# Altium project FIT_TCM.PrjPcb (part 8 of 9)

## Sheet FIT_HDMI_X21-17.SchDoc: FIT_PM12 board
size 420 x 297 mm; CheckedBy: G.Kasprowicz; Author: INR Moscow; CompanyName: WUT ISE; DrawnBy: M.Podgórski; Organization: WUT ISE; Address1: PW ISE; Address2: Nowowiejska 15/19 00-665 Warsaw; Address3: gkasprow@gmail.com; Revision: 2; SheetNumber: -; SheetTotal: -; ModifiedBy: -; CheckedDate: -; Title2: Title 2; DivGrp: WUT ISE; Designer: INR RAS; ModifiedDate: -; ProjectName: Sensor Box
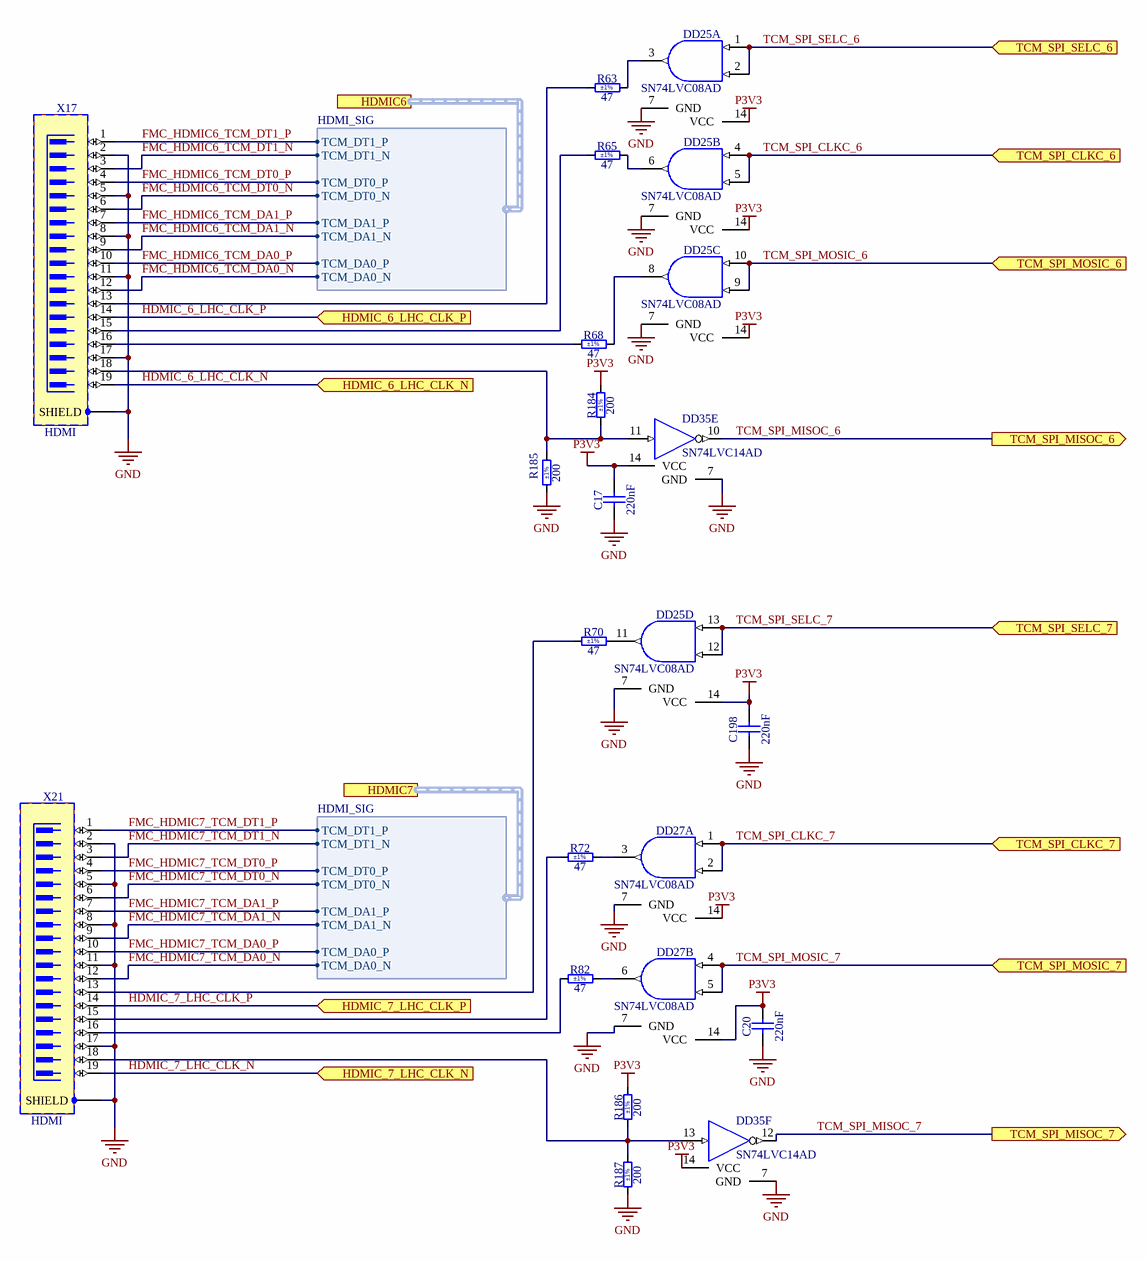
[diagram p27: FIT_HDMI_X21-17.SchDoc]

### Parts
C17  220nF  [CAPC2012X135N]
C20  220nF  [CAPC2012X135N]
C198  220nF  [CAPC2012X135N]
DD25  SN74LVC08AD  [SOIC127P600X175-14N]  (parts A,B,C,D of 4)
DD27  SN74LVC08AD  [SOIC127P600X175-14N]  (parts A,B of 4)
DD35  SN74LVC14AD  [SOIC127P600X175-14N]  (parts E,F of 6)
R63  47  Tolerance: ±1%  [RESC2012X60N]
R65  47  Tolerance: ±1%  [RESC2012X60N]
R68  47  Tolerance: ±1%  [RESC2012X60N]
R70  47  Tolerance: ±1%  [RESC2012X60N]
R72  47  Tolerance: ±1%  [RESC2012X60N]
R82  47  Tolerance: ±1%  [RESC2012X60N]
R184  200  Tolerance: ±1%  [RESC2012X60N]
R185  200  Tolerance: ±1%  [RESC2012X60N]
R186  200  Tolerance: ±1%  [RESC2012X60N]
R187  200  Tolerance: ±1%  [RESC2012X60N]
X17  HDMI  [TYCO_2007435-1]
X21  HDMI  [TYCO_2007435-1]

### Ports
HDMIC6 (harness HDMI_SIG), HDMIC7 (harness HDMI_SIG), HDMIC_6_LHC_CLK_N (in), HDMIC_6_LHC_CLK_P (in), HDMIC_7_LHC_CLK_N (in), HDMIC_7_LHC_CLK_P (in), TCM_SPI_CLKC_6 (in), TCM_SPI_CLKC_7 (in), TCM_SPI_MISOC_6 (out), TCM_SPI_MISOC_7 (out), TCM_SPI_MOSIC_6 (in), TCM_SPI_MOSIC_7 (in), TCM_SPI_SELC_6 (in), TCM_SPI_SELC_7 (in)

### Harnesses
HDMI_SIG: TCM_DT1_P, TCM_DT1_N, TCM_DT0_P, TCM_DT0_N, TCM_DA1_P, TCM_DA1_N, TCM_DA0_P, TCM_DA0_N

### Nets
GND: C17.1 C20.1 C198.1 DD25.7(GND) DD27.7(GND) DD35.7(GND) R185.1 R187.1 X17.2 X17.5 X17.8 X17.11 X17.17 X17.SHIELD X21.2 X21.5 X21.8 X21.11 X21.17 X21.SHIELD
P3V3: C17.2 C20.2 C198.2 DD25.14(VCC) DD27.14(VCC) DD35.14(VCC) R184.2 R186.2  [also labelled VCC]
FMC_HDMIC6_TCM_DA0_N: X17.12 ; port HDMIC6.TCM_DA0_N  [project net HDMIC6.TCM_DA0_N]
FMC_HDMIC6_TCM_DA0_P: X17.10 ; port HDMIC6.TCM_DA0_P  [project net HDMIC6.TCM_DA0_P]
FMC_HDMIC6_TCM_DA1_N: X17.9 ; port HDMIC6.TCM_DA1_N  [project net HDMIC6.TCM_DA1_N]
FMC_HDMIC6_TCM_DA1_P: X17.7 ; port HDMIC6.TCM_DA1_P  [project net HDMIC6.TCM_DA1_P]
FMC_HDMIC6_TCM_DT0_N: X17.6 ; port HDMIC6.TCM_DT0_N  [project net HDMIC6.TCM_DT0_N]
FMC_HDMIC6_TCM_DT0_P: X17.4 ; port HDMIC6.TCM_DT0_P  [project net HDMIC6.TCM_DT0_P]
FMC_HDMIC6_TCM_DT1_N: X17.3 ; port HDMIC6.TCM_DT1_N  [project net HDMIC6.TCM_DT1_N]
FMC_HDMIC6_TCM_DT1_P: X17.1 ; port HDMIC6.TCM_DT1_P  [project net HDMIC6.TCM_DT1_P]
FMC_HDMIC7_TCM_DA0_N: X21.12 ; port HDMIC7.TCM_DA0_N  [project net HDMIC7.TCM_DA0_N]
FMC_HDMIC7_TCM_DA0_P: X21.10 ; port HDMIC7.TCM_DA0_P  [project net HDMIC7.TCM_DA0_P]
FMC_HDMIC7_TCM_DA1_N: X21.9 ; port HDMIC7.TCM_DA1_N  [project net HDMIC7.TCM_DA1_N]
FMC_HDMIC7_TCM_DA1_P: X21.7 ; port HDMIC7.TCM_DA1_P  [project net HDMIC7.TCM_DA1_P]
FMC_HDMIC7_TCM_DT0_N: X21.6 ; port HDMIC7.TCM_DT0_N  [project net HDMIC7.TCM_DT0_N]
FMC_HDMIC7_TCM_DT0_P: X21.4 ; port HDMIC7.TCM_DT0_P  [project net HDMIC7.TCM_DT0_P]
FMC_HDMIC7_TCM_DT1_N: X21.3 ; port HDMIC7.TCM_DT1_N  [project net HDMIC7.TCM_DT1_N]
FMC_HDMIC7_TCM_DT1_P: X21.1 ; port HDMIC7.TCM_DT1_P  [project net HDMIC7.TCM_DT1_P]
HDMIC_6_LHC_CLK_N: X17.19 ; port HDMIC_6_LHC_CLK_N  [project net HDMIC_LHC.6_LHC_CLK_N]
HDMIC_6_LHC_CLK_P: X17.14 ; port HDMIC_6_LHC_CLK_P  [project net HDMIC_LHC.6_LHC_CLK_P]
HDMIC_7_LHC_CLK_N: X21.19 ; port HDMIC_7_LHC_CLK_N  [project net HDMIC_LHC.7_LHC_CLK_N]
HDMIC_7_LHC_CLK_P: X21.14 ; port HDMIC_7_LHC_CLK_P  [project net HDMIC_LHC.7_LHC_CLK_P]
TCM_SPI_CLKC_6: DD25.4(A) DD25.5(B) ; port TCM_SPI_CLKC_6
TCM_SPI_CLKC_7: DD27.1(A) DD27.2(B) ; port TCM_SPI_CLKC_7
TCM_SPI_MISOC_6: DD35.10(OUT) ; port TCM_SPI_MISOC_6
TCM_SPI_MISOC_7: DD35.12(OUT) ; port TCM_SPI_MISOC_7
TCM_SPI_MOSIC_6: DD25.9(B) DD25.10(A) ; port TCM_SPI_MOSIC_6
TCM_SPI_MOSIC_7: DD27.4(A) DD27.5(B) ; port TCM_SPI_MOSIC_7
TCM_SPI_SELC_6: DD25.1(A) DD25.2(B) ; port TCM_SPI_SELC_6
TCM_SPI_SELC_7: DD25.12(B) DD25.13(A) ; port TCM_SPI_SELC_7
NetDD25_3: DD25.3(Y) R63.2
NetDD25_6: DD25.6(Y) R65.2
NetDD25_8: DD25.8(Y) R68.2
NetDD25_11: DD25.11(Y) R70.2
NetDD27_3: DD27.3(Y) R72.2
NetDD27_6: DD27.6(Y) R82.2
NetDD35_11: DD35.11(IN) R184.1 R185.2 X17.18
NetDD35_13: DD35.13(IN) R186.1 R187.2 X21.18
NetR63_1: R63.1 X17.13
NetR65_1: R65.1 X17.15
NetR68_1: R68.1 X17.16
NetR70_1: R70.1 X21.13
NetR72_1: R72.1 X21.15
NetR82_1: R82.1 X21.16

### Notes on the sheet
- Project/Equipment
- Document
- Designer
- Drawn by
- Check.by
- Copyright WUT ISE 2024.
  This documentation describes Open Hardware and is licensed under the CERN OHL v.2. You may redistribute and modify this documentation under the terms of the CERN OHL v.2. (http://ohwr.org/CERNOHL). This documentation is distributed WITHOUT ANY EXPRESS OR IMPLIED WARRANTY, INCLUDING OF MERCHANTABILITY, SATISFACTORY QUALITY AND FITNESS FOR A PARTICULAR PURPOSE. Please see the CERN OHL v.2 for applicable conditions.
- Contact
- File
- Last Mod.
- Print Date
- Sheet
- Size
- A3
- of
- Rev

### Library data of the parts
C17 C20 C198 = CC0805_220NF_50V_10%_X7R: Non-polarised capacitor; Part Description: SMD Multilayer Chip Ceramic Capacitor; Manufacturer: GENERIC; Manufacturer1 Part Number: GRM21BR71H224KA01L; Voltage: 50V; TC: X7R; Tolerance: ±10%; Part Number: CC0805_220NF_50V_10%_X7R; Component Kind: Standard; Component Type: Standard; Pin Count: 2; Value: 220nF; Status: Preferred; Manufacturer Part Number: CC0805_220NF_50V_10%_X7R; Case: 0805; Mounted: Yes; Socket: No; SMD: Yes; Sense: No; Manufacturer1 Example: MURATA; Manufacturer1 ComponentHeight: 1.35mm; HelpURL: \\cern.ch\dfs\Applications\Altium\Datasheets\CC0805_X7R_MURATA.pdf; Author: CERN DEM JLC; CreateDate: 03.12.2007; LatestRevisionDate: 03.12.2007
DD25 DD27 = SN74LVC08AD: Quad 2-Input AND Gate; Part Description: Quadruple 2-Input Positive-AND Gate; Manufacturer: TEXAS INSTRUMENTS; PressFit: No; Bonding: No; Part Number: SN74LVC08AD; Component Kind: Standard; Component Type: Standard; Device: SN74LVC08AD; PackageDescription: SOIC 14, Pitch 1.27mm - Body 4x8.75mm, IPC Medium Density; Manufacturer Part Number: SN74LVC08AD; Pin Count: 14; Case: SOIC14; Mounted: Yes; Socket: No; SMD: Yes; Sense: No; ComponentHeight: 1.75mm; Author: CERN DEM JLC; HelpURL: \\cern.ch\dfs\Applications\Altium\Datasheets\SN74LVC08AD.pdf; CreateDate: 21.03.2012; LatestRevisionDate: 21.03.2012
DD35 = SN74LVC14AD: Hex Schmitt-Trigger Inverter; Manufacturer: TEXAS INSTRUMENTS; PressFit: No; Bonding: No; Part Number: SN74LVC14AD; Component Kind: Standard; Component Type: Standard; Device: SN74LVC14AD; PackageDescription: SOIC 14, Pitch 1.27mm - Body 4x8.75mm, IPC Medium Density; Part Description: Hex Schmitt-Trigger Inverter; Manufacturer Part Number: SN74LVC14AD; Pin Count: 14; Case: SOIC14; Mounted: Yes; Socket: No; SMD: Yes; Sense: No; ComponentHeight: 1.75mm; Author: CERN DEM JMW; HelpURL: \\cern.ch\dfs\Applications\Altium\Datasheets\SN74LVC14AD.pdf; CreateDate: 29.09.2008; LatestRevisionDate: 29.09.2008
R63 R65 R68 R70 R72 R82 = R0805_47R_1%_0.125W_100PPM: Resistor - 1%; Part Description: General Purpose Thick Film Chip Resistor; Manufacturer: GENERIC; Manufacturer1 Part Number: NRC10F47R0TRF; Power: 0.125W; TC: ±100ppm/°C; PressFit: No; Part Number: R0805_47R_1%_0.125W_100PPM; Component Kind: Standard; Component Type: Standard; Pin Count: 2; Value: 47; Status: Preferred; Manufacturer Part Number: R0805_47R_1%_0.125W_100PPM; Case: 0805; Mounted: Yes; Sense: No; Socket: No; SMD: Yes; Manufacturer1 Example: NIC COMPONENT; Manufacturer1 ComponentHeight: 0.6mm; HelpURL: \\cern.ch\dfs\Applications\Altium\Datasheets\R0805_NIC_NRC.pdf; Author: CERN DEM JLC; CreateDate: 03.12.2007; LatestRevisionDate: 13.03.2008
R184-R187 = R0805_200R_1%_0.125W_100PPM: Resistor - 1%; Part Description: General Purpose Thick Film Chip Resistor; Manufacturer: GENERIC; Manufacturer1 Part Number: NRC10F2000TRF; Power: 0.125W; TC: ±100ppm/°C; PressFit: No; Part Number: R0805_200R_1%_0.125W_100PPM; Component Kind: Standard; Component Type: Standard; Pin Count: 2; Value: 200; Status: Preferred; Manufacturer Part Number: R0805_200R_1%_0.125W_100PPM; Case: 0805; Mounted: Yes; Sense: No; Socket: No; SMD: Yes; Manufacturer1 Example: NIC COMPONENT; Manufacturer1 ComponentHeight: 0.6mm; HelpURL: \\cern.ch\dfs\Applications\Altium\Datasheets\R0805_NIC_NRC.pdf; Author: CERN DEM JLC; CreateDate: 03.12.2007; LatestRevisionDate: 13.03.2008
X17 X21 = TYCO_2007435-1: Connector HDMI 19 Male + 1 Shield; Part Description: 0.578mm Pitch, Through-Hole Right Angle 19 Contacts Flag-HDMI Type-A Receptacle Thru Hole Mounting Pads; Manufacturer: TYCO ELECTRONICS; PressFit: No; Part Number: TYCO_2007435-1; Component Kind: Standard; Component Type: Standard; Pin Count: 23; Family: HDMI; Mounted: Yes; Socket: No; SMD: No; Sense: No; Status: None; Manufacturer Part Number: 2007435-1; ComponentHeight: 16.4mm; HelpURL: \\cern.ch\dfs\Applications\Altium\Datasheets\TYCO_2007435-1.pdf; Author: CERN DEM MR; CreateDate: 05.07.2016; LatestRevisionDate: 05.07.2016

## Sheet FIT_HDMI_X34-28.SchDoc: FIT_PM12 board
size 420 x 297 mm; CheckedBy: G.Kasprowicz; Author: INR Moscow; CompanyName: WUT ISE; DrawnBy: M.Podgórski; Organization: WUT ISE; Address1: PW ISE; Address2: Nowowiejska 15/19 00-665 Warsaw; Address3: gkasprow@gmail.com; Revision: 2; SheetNumber: -; SheetTotal: -; ModifiedBy: -; CheckedDate: -; Title2: Title 2; DivGrp: WUT ISE; Designer: INR RAS; ModifiedDate: -; ProjectName: Sensor Box
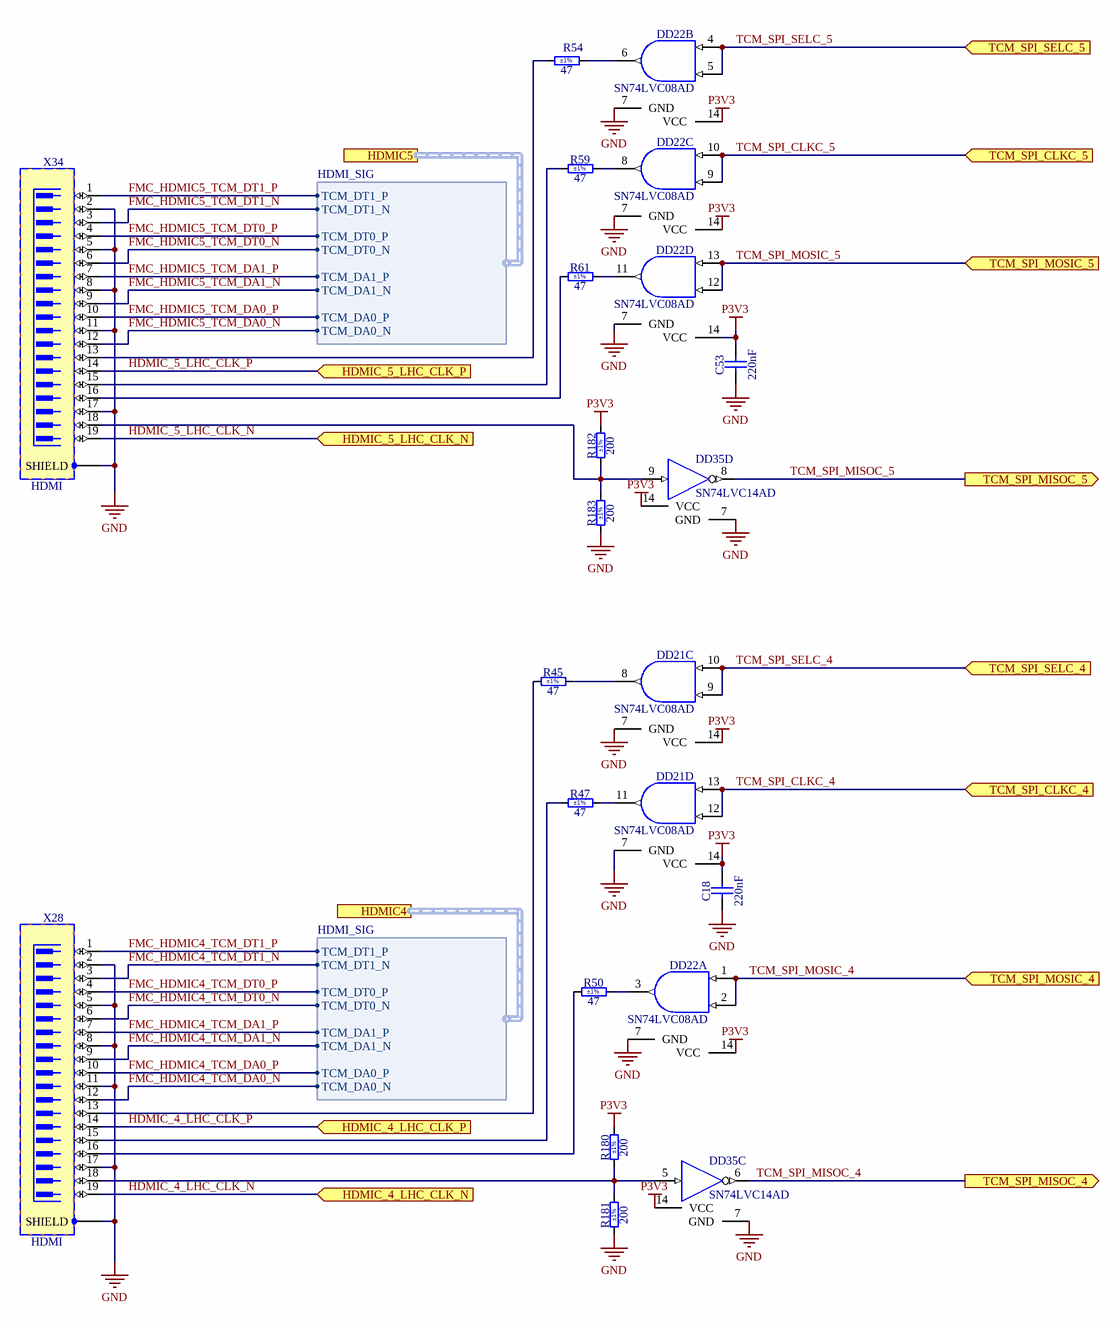
[diagram p28: FIT_HDMI_X34-28.SchDoc]

### Parts
C18  220nF  [CAPC2012X135N]
C53  220nF  [CAPC2012X135N]
DD21  SN74LVC08AD  [SOIC127P600X175-14N]  (parts C,D of 4)
DD22  SN74LVC08AD  [SOIC127P600X175-14N]  (parts A,B,C,D of 4)
DD35  SN74LVC14AD  [SOIC127P600X175-14N]  (parts C,D of 6)
R45  47  Tolerance: ±1%  [RESC2012X60N]
R47  47  Tolerance: ±1%  [RESC2012X60N]
R50  47  Tolerance: ±1%  [RESC2012X60N]
R54  47  Tolerance: ±1%  [RESC2012X60N]
R59  47  Tolerance: ±1%  [RESC2012X60N]
R61  47  Tolerance: ±1%  [RESC2012X60N]
R180  200  Tolerance: ±1%  [RESC2012X60N]
R181  200  Tolerance: ±1%  [RESC2012X60N]
R182  200  Tolerance: ±1%  [RESC2012X60N]
R183  200  Tolerance: ±1%  [RESC2012X60N]
X28  HDMI  [TYCO_2007435-1]
X34  HDMI  [TYCO_2007435-1]

### Ports
HDMIC4 (harness HDMI_SIG), HDMIC5 (harness HDMI_SIG), HDMIC_4_LHC_CLK_N (in), HDMIC_4_LHC_CLK_P (in), HDMIC_5_LHC_CLK_N (in), HDMIC_5_LHC_CLK_P (in), TCM_SPI_CLKC_4 (in), TCM_SPI_CLKC_5 (in), TCM_SPI_MISOC_4 (out), TCM_SPI_MISOC_5 (out), TCM_SPI_MOSIC_4 (in), TCM_SPI_MOSIC_5 (in), TCM_SPI_SELC_4 (in), TCM_SPI_SELC_5 (in)

### Harnesses
HDMI_SIG: TCM_DT1_P, TCM_DT1_N, TCM_DT0_P, TCM_DT0_N, TCM_DA1_P, TCM_DA1_N, TCM_DA0_P, TCM_DA0_N

### Nets
GND: C18.1 C53.1 DD21.7(GND) DD22.7(GND) DD35.7(GND) R181.1 R183.1 X28.2 X28.5 X28.8 X28.11 X28.17 X28.SHIELD X34.2 X34.5 X34.8 X34.11 X34.17 X34.SHIELD
P3V3: C18.2 C53.2 DD21.14(VCC) DD22.14(VCC) DD35.14(VCC) R180.2 R182.2  [also labelled VCC]
FMC_HDMIC4_TCM_DA0_N: X28.12 ; port HDMIC4.TCM_DA0_N  [project net HDMIC4.TCM_DA0_N]
FMC_HDMIC4_TCM_DA0_P: X28.10 ; port HDMIC4.TCM_DA0_P  [project net HDMIC4.TCM_DA0_P]
FMC_HDMIC4_TCM_DA1_N: X28.9 ; port HDMIC4.TCM_DA1_N  [project net HDMIC4.TCM_DA1_N]
FMC_HDMIC4_TCM_DA1_P: X28.7 ; port HDMIC4.TCM_DA1_P  [project net HDMIC4.TCM_DA1_P]
FMC_HDMIC4_TCM_DT0_N: X28.6 ; port HDMIC4.TCM_DT0_N  [project net HDMIC4.TCM_DT0_N]
FMC_HDMIC4_TCM_DT0_P: X28.4 ; port HDMIC4.TCM_DT0_P  [project net HDMIC4.TCM_DT0_P]
FMC_HDMIC4_TCM_DT1_N: X28.3 ; port HDMIC4.TCM_DT1_N  [project net HDMIC4.TCM_DT1_N]
FMC_HDMIC4_TCM_DT1_P: X28.1 ; port HDMIC4.TCM_DT1_P  [project net HDMIC4.TCM_DT1_P]
FMC_HDMIC5_TCM_DA0_N: X34.12 ; port HDMIC5.TCM_DA0_N  [project net HDMIC5.TCM_DA0_N]
FMC_HDMIC5_TCM_DA0_P: X34.10 ; port HDMIC5.TCM_DA0_P  [project net HDMIC5.TCM_DA0_P]
FMC_HDMIC5_TCM_DA1_N: X34.9 ; port HDMIC5.TCM_DA1_N  [project net HDMIC5.TCM_DA1_N]
FMC_HDMIC5_TCM_DA1_P: X34.7 ; port HDMIC5.TCM_DA1_P  [project net HDMIC5.TCM_DA1_P]
FMC_HDMIC5_TCM_DT0_N: X34.6 ; port HDMIC5.TCM_DT0_N  [project net HDMIC5.TCM_DT0_N]
FMC_HDMIC5_TCM_DT0_P: X34.4 ; port HDMIC5.TCM_DT0_P  [project net HDMIC5.TCM_DT0_P]
FMC_HDMIC5_TCM_DT1_N: X34.3 ; port HDMIC5.TCM_DT1_N  [project net HDMIC5.TCM_DT1_N]
FMC_HDMIC5_TCM_DT1_P: X34.1 ; port HDMIC5.TCM_DT1_P  [project net HDMIC5.TCM_DT1_P]
HDMIC_4_LHC_CLK_N: X28.19 ; port HDMIC_4_LHC_CLK_N  [project net HDMIC_LHC.4_LHC_CLK_N]
HDMIC_4_LHC_CLK_P: X28.14 ; port HDMIC_4_LHC_CLK_P  [project net HDMIC_LHC.4_LHC_CLK_P]
HDMIC_5_LHC_CLK_N: X34.19 ; port HDMIC_5_LHC_CLK_N  [project net HDMIC_LHC.5_LHC_CLK_N]
HDMIC_5_LHC_CLK_P: X34.14 ; port HDMIC_5_LHC_CLK_P  [project net HDMIC_LHC.5_LHC_CLK_P]
TCM_SPI_CLKC_4: DD21.12(B) DD21.13(A) ; port TCM_SPI_CLKC_4
TCM_SPI_CLKC_5: DD22.9(B) DD22.10(A) ; port TCM_SPI_CLKC_5
TCM_SPI_MISOC_4: DD35.6(OUT) ; port TCM_SPI_MISOC_4
TCM_SPI_MISOC_5: DD35.8(OUT) ; port TCM_SPI_MISOC_5
TCM_SPI_MOSIC_4: DD22.1(A) DD22.2(B) ; port TCM_SPI_MOSIC_4
TCM_SPI_MOSIC_5: DD22.12(B) DD22.13(A) ; port TCM_SPI_MOSIC_5
TCM_SPI_SELC_4: DD21.9(B) DD21.10(A) ; port TCM_SPI_SELC_4
TCM_SPI_SELC_5: DD22.4(A) DD22.5(B) ; port TCM_SPI_SELC_5
NetDD21_8: DD21.8(Y) R45.2
NetDD21_11: DD21.11(Y) R47.2
NetDD22_3: DD22.3(Y) R50.2
NetDD22_6: DD22.6(Y) R54.2
NetDD22_8: DD22.8(Y) R59.2
NetDD22_11: DD22.11(Y) R61.2
NetDD35_5: DD35.5(IN) R180.1 R181.2 X28.18
NetDD35_9: DD35.9(IN) R182.1 R183.2 X34.18
NetR45_1: R45.1 X28.13
NetR47_1: R47.1 X28.15
NetR50_1: R50.1 X28.16
NetR54_1: R54.1 X34.13
NetR59_1: R59.1 X34.15
NetR61_1: R61.1 X34.16

### Notes on the sheet
- Project/Equipment
- Document
- Designer
- Drawn by
- Check.by
- Copyright WUT ISE 2024.
  This documentation describes Open Hardware and is licensed under the CERN OHL v.2. You may redistribute and modify this documentation under the terms of the CERN OHL v.2. (http://ohwr.org/CERNOHL). This documentation is distributed WITHOUT ANY EXPRESS OR IMPLIED WARRANTY, INCLUDING OF MERCHANTABILITY, SATISFACTORY QUALITY AND FITNESS FOR A PARTICULAR PURPOSE. Please see the CERN OHL v.2 for applicable conditions.
- Contact
- File
- Last Mod.
- Print Date
- Sheet
- Size
- A3
- of
- Rev

### Library data of the parts
C18 C53 = CC0805_220NF_50V_10%_X7R: as C17 on sheet FIT_HDMI_X21-17; Part Number: CC0805_220NF_50V_10%_X7R; Component Kind: Standard; Component Type: Standard; Pin Count: 2; Value: 220nF; Status: Preferred; Manufacturer Part Number: CC0805_220NF_50V_10%_X7R; Case: 0805; Mounted: Yes; Socket: No; SMD: Yes; Sense: No; Manufacturer1 Example: MURATA; Manufacturer1 ComponentHeight: 1.35mm; HelpURL: \\cern.ch\dfs\Applications\Altium\Datasheets\CC0805_X7R_MURATA.pdf; Author: CERN DEM JLC; CreateDate: 03.12.2007; LatestRevisionDate: 03.12.2007
DD21 DD22 = SN74LVC08AD: as DD25 on sheet FIT_HDMI_X21-17; Part Number: SN74LVC08AD; Component Kind: Standard; Component Type: Standard; Device: SN74LVC08AD; PackageDescription: SOIC 14, Pitch 1.27mm - Body 4x8.75mm, IPC Medium Density; Manufacturer Part Number: SN74LVC08AD; Pin Count: 14; Case: SOIC14; Mounted: Yes; Socket: No; SMD: Yes; Sense: No; ComponentHeight: 1.75mm; Author: CERN DEM JLC; HelpURL: \\cern.ch\dfs\Applications\Altium\Datasheets\SN74LVC08AD.pdf; CreateDate: 21.03.2012; LatestRevisionDate: 21.03.2012
DD35 = SN74LVC14AD: as DD35 on sheet FIT_HDMI_X21-17; Part Number: SN74LVC14AD; Component Kind: Standard; Component Type: Standard; Device: SN74LVC14AD; PackageDescription: SOIC 14, Pitch 1.27mm - Body 4x8.75mm, IPC Medium Density; Part Description: Hex Schmitt-Trigger Inverter; Manufacturer Part Number: SN74LVC14AD; Pin Count: 14; Case: SOIC14; Mounted: Yes; Socket: No; SMD: Yes; Sense: No; ComponentHeight: 1.75mm; Author: CERN DEM JMW; HelpURL: \\cern.ch\dfs\Applications\Altium\Datasheets\SN74LVC14AD.pdf; CreateDate: 29.09.2008; LatestRevisionDate: 29.09.2008
R45 R47 R50 R54 R59 R61 = R0805_47R_1%_0.125W_100PPM: as R63 on sheet FIT_HDMI_X21-17; Part Number: R0805_47R_1%_0.125W_100PPM; Component Kind: Standard; Component Type: Standard; Pin Count: 2; Value: 47; Status: Preferred; Manufacturer Part Number: R0805_47R_1%_0.125W_100PPM; Case: 0805; Mounted: Yes; Sense: No; Socket: No; SMD: Yes; Manufacturer1 Example: NIC COMPONENT; Manufacturer1 ComponentHeight: 0.6mm; HelpURL: \\cern.ch\dfs\Applications\Altium\Datasheets\R0805_NIC_NRC.pdf; Author: CERN DEM JLC; CreateDate: 03.12.2007; LatestRevisionDate: 13.03.2008
R180-R183 = R0805_200R_1%_0.125W_100PPM: as R184-R187 on sheet FIT_HDMI_X21-17; Part Number: R0805_200R_1%_0.125W_100PPM; Component Kind: Standard; Component Type: Standard; Pin Count: 2; Value: 200; Status: Preferred; Manufacturer Part Number: R0805_200R_1%_0.125W_100PPM; Case: 0805; Mounted: Yes; Sense: No; Socket: No; SMD: Yes; Manufacturer1 Example: NIC COMPONENT; Manufacturer1 ComponentHeight: 0.6mm; HelpURL: \\cern.ch\dfs\Applications\Altium\Datasheets\R0805_NIC_NRC.pdf; Author: CERN DEM JLC; CreateDate: 03.12.2007; LatestRevisionDate: 13.03.2008
X28 X34 = TYCO_2007435-1: as X17 on sheet FIT_HDMI_X21-17; Part Number: TYCO_2007435-1; Component Kind: Standard; Component Type: Standard; Pin Count: 23; Family: HDMI; Mounted: Yes; Socket: No; SMD: No; Sense: No; Status: None; Manufacturer Part Number: 2007435-1; ComponentHeight: 16.4mm; HelpURL: \\cern.ch\dfs\Applications\Altium\Datasheets\TYCO_2007435-1.pdf; Author: CERN DEM MR; CreateDate: 05.07.2016; LatestRevisionDate: 05.07.2016

## Sheet FIT_HDMI_X24-20.SchDoc: FIT_PM12 board
size 420 x 297 mm; CheckedBy: G.Kasprowicz; Author: INR Moscow; CompanyName: WUT ISE; DrawnBy: M.Podgórski; Organization: WUT ISE; Address1: PW ISE; Address2: Nowowiejska 15/19 00-665 Warsaw; Address3: gkasprow@gmail.com; Revision: 2; SheetNumber: -; SheetTotal: -; ModifiedBy: -; CheckedDate: -; Title2: Title 2; DivGrp: WUT ISE; Designer: INR RAS; ModifiedDate: -; ProjectName: Sensor Box
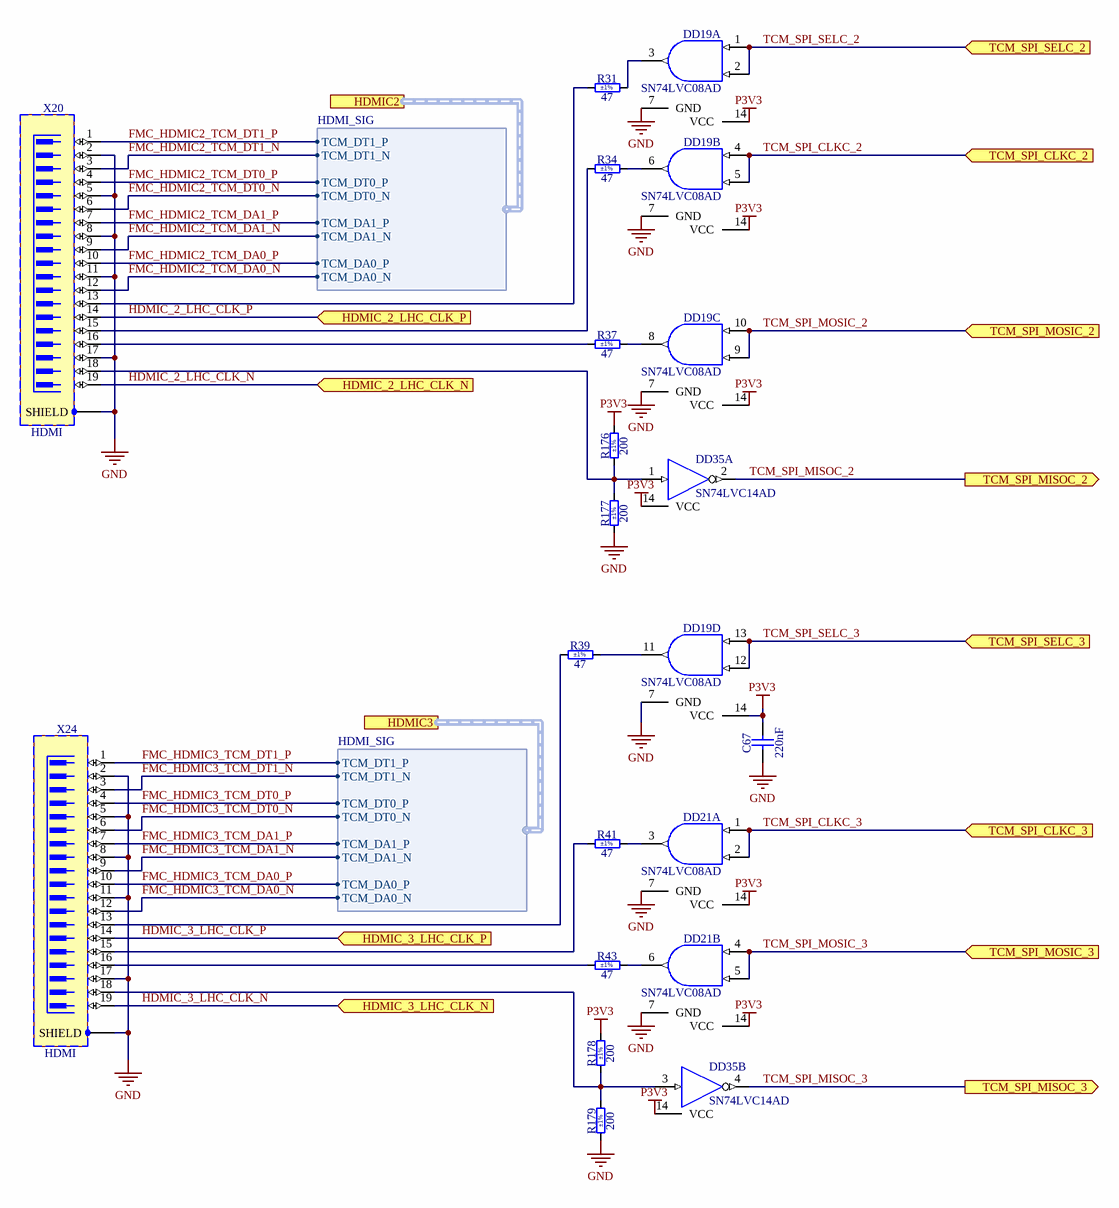
[diagram p29: FIT_HDMI_X24-20.SchDoc]

### Parts
C67  220nF  [CAPC2012X135N]
DD19  SN74LVC08AD  [SOIC127P600X175-14N]  (parts A,B,C,D of 4)
DD21  SN74LVC08AD  [SOIC127P600X175-14N]  (parts A,B of 4)
DD35  SN74LVC14AD  [SOIC127P600X175-14N]  (parts A,B of 6)
R31  47  Tolerance: ±1%  [RESC2012X60N]
R34  47  Tolerance: ±1%  [RESC2012X60N]
R37  47  Tolerance: ±1%  [RESC2012X60N]
R39  47  Tolerance: ±1%  [RESC2012X60N]
R41  47  Tolerance: ±1%  [RESC2012X60N]
R43  47  Tolerance: ±1%  [RESC2012X60N]
R176  200  Tolerance: ±1%  [RESC2012X60N]
R177  200  Tolerance: ±1%  [RESC2012X60N]
R178  200  Tolerance: ±1%  [RESC2012X60N]
R179  200  Tolerance: ±1%  [RESC2012X60N]
X20  HDMI  [TYCO_2007435-1]
X24  HDMI  [TYCO_2007435-1]

### Ports
HDMIC2 (harness HDMI_SIG), HDMIC3 (harness HDMI_SIG), HDMIC_2_LHC_CLK_N (in), HDMIC_2_LHC_CLK_P (in), HDMIC_3_LHC_CLK_N (in), HDMIC_3_LHC_CLK_P (in), TCM_SPI_CLKC_2 (in), TCM_SPI_CLKC_3 (in), TCM_SPI_MISOC_2 (out), TCM_SPI_MISOC_3 (out), TCM_SPI_MOSIC_2 (in), TCM_SPI_MOSIC_3 (in), TCM_SPI_SELC_2 (in), TCM_SPI_SELC_3 (in)

### Harnesses
HDMI_SIG: TCM_DT1_P, TCM_DT1_N, TCM_DT0_P, TCM_DT0_N, TCM_DA1_P, TCM_DA1_N, TCM_DA0_P, TCM_DA0_N

### Nets
GND: C67.1 DD19.7(GND) DD21.7(GND) DD35.7(GND) R177.1 R179.1 X20.2 X20.5 X20.8 X20.11 X20.17 X20.SHIELD X24.2 X24.5 X24.8 X24.11 X24.17 X24.SHIELD
P3V3: C67.2 DD19.14(VCC) DD21.14(VCC) DD35.14(VCC) R176.2 R178.2  [also labelled VCC]
FMC_HDMIC2_TCM_DA0_N: X20.12 ; port HDMIC2.TCM_DA0_N  [project net HDMIC2.TCM_DA0_N]
FMC_HDMIC2_TCM_DA0_P: X20.10 ; port HDMIC2.TCM_DA0_P  [project net HDMIC2.TCM_DA0_P]
FMC_HDMIC2_TCM_DA1_N: X20.9 ; port HDMIC2.TCM_DA1_N  [project net HDMIC2.TCM_DA1_N]
FMC_HDMIC2_TCM_DA1_P: X20.7 ; port HDMIC2.TCM_DA1_P  [project net HDMIC2.TCM_DA1_P]
FMC_HDMIC2_TCM_DT0_N: X20.6 ; port HDMIC2.TCM_DT0_N  [project net HDMIC2.TCM_DT0_N]
FMC_HDMIC2_TCM_DT0_P: X20.4 ; port HDMIC2.TCM_DT0_P  [project net HDMIC2.TCM_DT0_P]
FMC_HDMIC2_TCM_DT1_N: X20.3 ; port HDMIC2.TCM_DT1_N  [project net HDMIC2.TCM_DT1_N]
FMC_HDMIC2_TCM_DT1_P: X20.1 ; port HDMIC2.TCM_DT1_P  [project net HDMIC2.TCM_DT1_P]
FMC_HDMIC3_TCM_DA0_N: X24.12 ; port HDMIC3.TCM_DA0_N  [project net HDMIC3.TCM_DA0_N]
FMC_HDMIC3_TCM_DA0_P: X24.10 ; port HDMIC3.TCM_DA0_P  [project net HDMIC3.TCM_DA0_P]
FMC_HDMIC3_TCM_DA1_N: X24.9 ; port HDMIC3.TCM_DA1_N  [project net HDMIC3.TCM_DA1_N]
FMC_HDMIC3_TCM_DA1_P: X24.7 ; port HDMIC3.TCM_DA1_P  [project net HDMIC3.TCM_DA1_P]
FMC_HDMIC3_TCM_DT0_N: X24.6 ; port HDMIC3.TCM_DT0_N  [project net HDMIC3.TCM_DT0_N]
FMC_HDMIC3_TCM_DT0_P: X24.4 ; port HDMIC3.TCM_DT0_P  [project net HDMIC3.TCM_DT0_P]
FMC_HDMIC3_TCM_DT1_N: X24.3 ; port HDMIC3.TCM_DT1_N  [project net HDMIC3.TCM_DT1_N]
FMC_HDMIC3_TCM_DT1_P: X24.1 ; port HDMIC3.TCM_DT1_P  [project net HDMIC3.TCM_DT1_P]
HDMIC_2_LHC_CLK_N: X20.19 ; port HDMIC_2_LHC_CLK_N  [project net HDMIC_LHC.2_LHC_CLK_N]
HDMIC_2_LHC_CLK_P: X20.14 ; port HDMIC_2_LHC_CLK_P  [project net HDMIC_LHC.2_LHC_CLK_P]
HDMIC_3_LHC_CLK_N: X24.19 ; port HDMIC_3_LHC_CLK_N  [project net HDMIC_LHC.3_LHC_CLK_N]
HDMIC_3_LHC_CLK_P: X24.14 ; port HDMIC_3_LHC_CLK_P  [project net HDMIC_LHC.3_LHC_CLK_P]
TCM_SPI_CLKC_2: DD19.4(A) DD19.5(B) ; port TCM_SPI_CLKC_2
TCM_SPI_CLKC_3: DD21.1(A) DD21.2(B) ; port TCM_SPI_CLKC_3
TCM_SPI_MISOC_2: DD35.2(OUT) ; port TCM_SPI_MISOC_2
TCM_SPI_MISOC_3: DD35.4(OUT) ; port TCM_SPI_MISOC_3
TCM_SPI_MOSIC_2: DD19.9(B) DD19.10(A) ; port TCM_SPI_MOSIC_2
TCM_SPI_MOSIC_3: DD21.4(A) DD21.5(B) ; port TCM_SPI_MOSIC_3
TCM_SPI_SELC_2: DD19.1(A) DD19.2(B) ; port TCM_SPI_SELC_2
TCM_SPI_SELC_3: DD19.12(B) DD19.13(A) ; port TCM_SPI_SELC_3
NetDD19_3: DD19.3(Y) R31.2
NetDD19_6: DD19.6(Y) R34.2
NetDD19_8: DD19.8(Y) R37.2
NetDD19_11: DD19.11(Y) R39.2
NetDD21_3: DD21.3(Y) R41.2
NetDD21_6: DD21.6(Y) R43.2
NetDD35_1: DD35.1(IN) R176.1 R177.2 X20.18
NetDD35_3: DD35.3(IN) R178.1 R179.2 X24.18
NetR31_1: R31.1 X20.13
NetR34_1: R34.1 X20.15
NetR37_1: R37.1 X20.16
NetR39_1: R39.1 X24.13
NetR41_1: R41.1 X24.15
NetR43_1: R43.1 X24.16

### Notes on the sheet
- Project/Equipment
- Document
- Designer
- Drawn by
- Check.by
- Copyright WUT ISE 2024.
  This documentation describes Open Hardware and is licensed under the CERN OHL v.2. You may redistribute and modify this documentation under the terms of the CERN OHL v.2. (http://ohwr.org/CERNOHL). This documentation is distributed WITHOUT ANY EXPRESS OR IMPLIED WARRANTY, INCLUDING OF MERCHANTABILITY, SATISFACTORY QUALITY AND FITNESS FOR A PARTICULAR PURPOSE. Please see the CERN OHL v.2 for applicable conditions.
- Contact
- File
- Last Mod.
- Print Date
- Sheet
- Size
- A3
- of
- Rev

### Library data of the parts
C67 = CC0805_220NF_50V_10%_X7R: as C17 on sheet FIT_HDMI_X21-17; Part Number: CC0805_220NF_50V_10%_X7R; Component Kind: Standard; Component Type: Standard; Pin Count: 2; Value: 220nF; Status: Preferred; Manufacturer Part Number: CC0805_220NF_50V_10%_X7R; Case: 0805; Mounted: Yes; Socket: No; SMD: Yes; Sense: No; Manufacturer1 Example: MURATA; Manufacturer1 ComponentHeight: 1.35mm; HelpURL: \\cern.ch\dfs\Applications\Altium\Datasheets\CC0805_X7R_MURATA.pdf; Author: CERN DEM JLC; CreateDate: 03.12.2007; LatestRevisionDate: 03.12.2007
DD19 DD21 = SN74LVC08AD: as DD25 on sheet FIT_HDMI_X21-17; Part Number: SN74LVC08AD; Component Kind: Standard; Component Type: Standard; Device: SN74LVC08AD; PackageDescription: SOIC 14, Pitch 1.27mm - Body 4x8.75mm, IPC Medium Density; Manufacturer Part Number: SN74LVC08AD; Pin Count: 14; Case: SOIC14; Mounted: Yes; Socket: No; SMD: Yes; Sense: No; ComponentHeight: 1.75mm; Author: CERN DEM JLC; HelpURL: \\cern.ch\dfs\Applications\Altium\Datasheets\SN74LVC08AD.pdf; CreateDate: 21.03.2012; LatestRevisionDate: 21.03.2012
DD35 = SN74LVC14AD: as DD35 on sheet FIT_HDMI_X21-17; Part Number: SN74LVC14AD; Component Kind: Standard; Component Type: Standard; Device: SN74LVC14AD; PackageDescription: SOIC 14, Pitch 1.27mm - Body 4x8.75mm, IPC Medium Density; Part Description: Hex Schmitt-Trigger Inverter; Manufacturer Part Number: SN74LVC14AD; Pin Count: 14; Case: SOIC14; Mounted: Yes; Socket: No; SMD: Yes; Sense: No; ComponentHeight: 1.75mm; Author: CERN DEM JMW; HelpURL: \\cern.ch\dfs\Applications\Altium\Datasheets\SN74LVC14AD.pdf; CreateDate: 29.09.2008; LatestRevisionDate: 29.09.2008
R31 R34 R37 R39 R41 R43 = R0805_47R_1%_0.125W_100PPM: as R63 on sheet FIT_HDMI_X21-17; Part Number: R0805_47R_1%_0.125W_100PPM; Component Kind: Standard; Component Type: Standard; Pin Count: 2; Value: 47; Status: Preferred; Manufacturer Part Number: R0805_47R_1%_0.125W_100PPM; Case: 0805; Mounted: Yes; Sense: No; Socket: No; SMD: Yes; Manufacturer1 Example: NIC COMPONENT; Manufacturer1 ComponentHeight: 0.6mm; HelpURL: \\cern.ch\dfs\Applications\Altium\Datasheets\R0805_NIC_NRC.pdf; Author: CERN DEM JLC; CreateDate: 03.12.2007; LatestRevisionDate: 13.03.2008
R176-R179 = R0805_200R_1%_0.125W_100PPM: as R184-R187 on sheet FIT_HDMI_X21-17; Part Number: R0805_200R_1%_0.125W_100PPM; Component Kind: Standard; Component Type: Standard; Pin Count: 2; Value: 200; Status: Preferred; Manufacturer Part Number: R0805_200R_1%_0.125W_100PPM; Case: 0805; Mounted: Yes; Sense: No; Socket: No; SMD: Yes; Manufacturer1 Example: NIC COMPONENT; Manufacturer1 ComponentHeight: 0.6mm; HelpURL: \\cern.ch\dfs\Applications\Altium\Datasheets\R0805_NIC_NRC.pdf; Author: CERN DEM JLC; CreateDate: 03.12.2007; LatestRevisionDate: 13.03.2008
X20 X24 = TYCO_2007435-1: as X17 on sheet FIT_HDMI_X21-17; Part Number: TYCO_2007435-1; Component Kind: Standard; Component Type: Standard; Pin Count: 23; Family: HDMI; Mounted: Yes; Socket: No; SMD: No; Sense: No; Status: None; Manufacturer Part Number: 2007435-1; ComponentHeight: 16.4mm; HelpURL: \\cern.ch\dfs\Applications\Altium\Datasheets\TYCO_2007435-1.pdf; Author: CERN DEM MR; CreateDate: 05.07.2016; LatestRevisionDate: 05.07.2016

## Sheet FIT_HDMI_X16-33.SchDoc: FIT_PM12 board
size 420 x 297 mm; CheckedBy: G.Kasprowicz; Author: INR Moscow; CompanyName: WUT ISE; DrawnBy: M.Podgórski; Organization: WUT ISE; Address1: PW ISE; Address2: Nowowiejska 15/19 00-665 Warsaw; Address3: gkasprow@gmail.com; Revision: 2; SheetNumber: -; SheetTotal: -; ModifiedBy: -; CheckedDate: -; Title2: Title 2; DivGrp: WUT ISE; Designer: INR RAS; ModifiedDate: -; ProjectName: Sensor Box
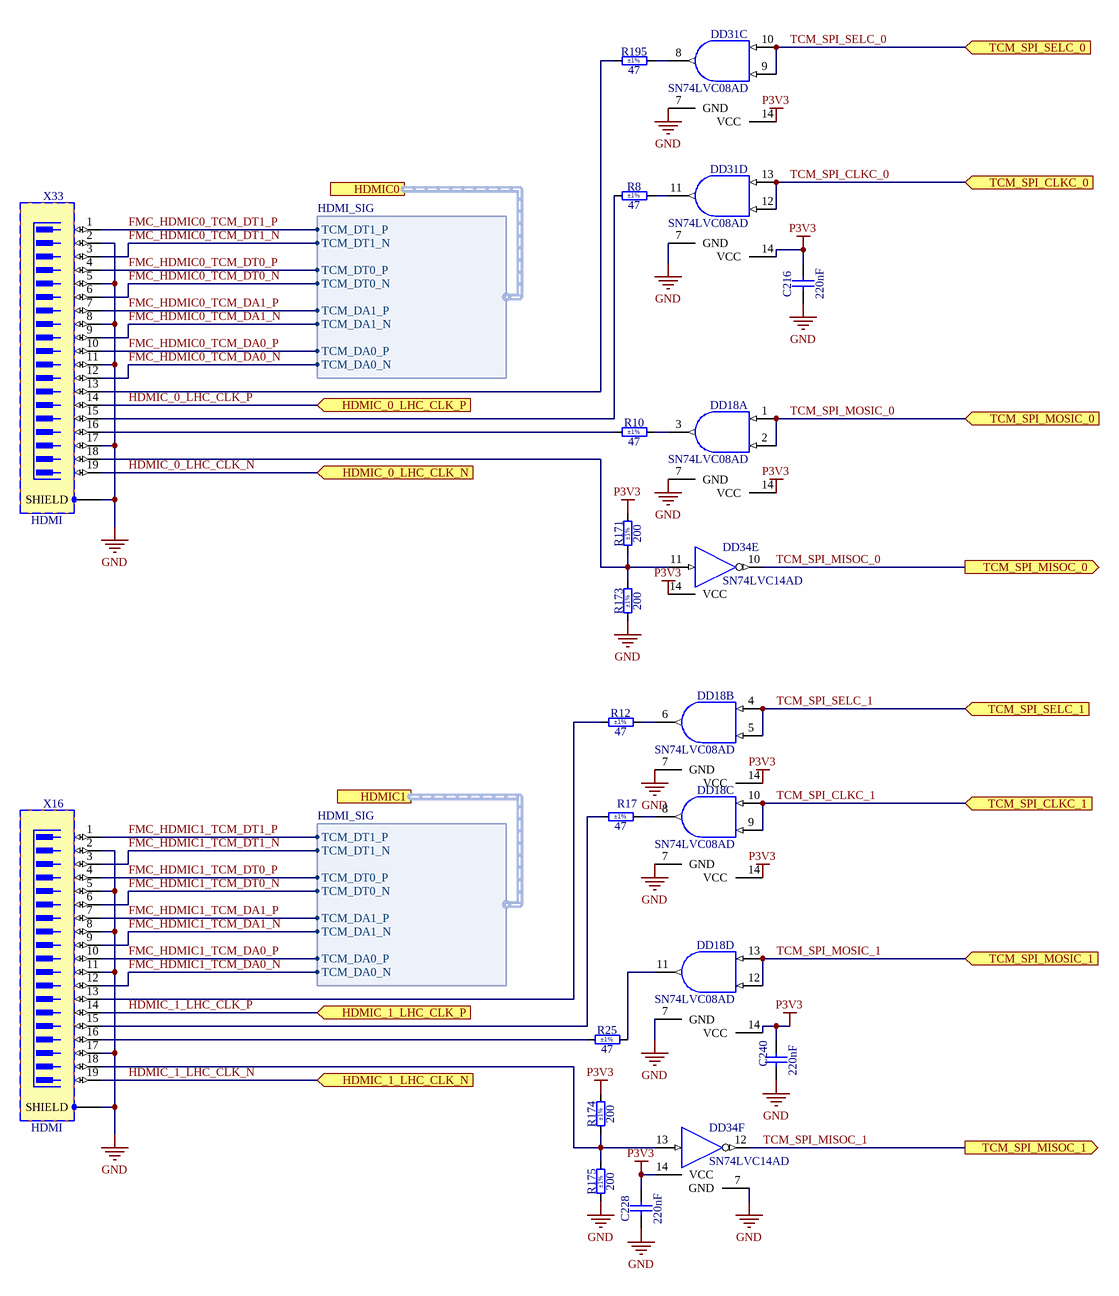
[diagram p30: FIT_HDMI_X16-33.SchDoc]

### Parts
C216  220nF  [CAPC2012X135N]
C228  220nF  [CAPC2012X135N]
C240  220nF  [CAPC2012X135N]
DD18  SN74LVC08AD  [SOIC127P600X175-14N]  (parts A,B,C,D of 4)
DD31  SN74LVC08AD  [SOIC127P600X175-14N]  (parts C,D of 4)
DD34  SN74LVC14AD  [SOIC127P600X175-14N]  (parts E,F of 6)
R8  47  Tolerance: ±1%  [RESC2012X60N]
R10  47  Tolerance: ±1%  [RESC2012X60N]
R12  47  Tolerance: ±1%  [RESC2012X60N]
R17  47  Tolerance: ±1%  [RESC2012X60N]
R25  47  Tolerance: ±1%  [RESC2012X60N]
R171  200  Tolerance: ±1%  [RESC2012X60N]
R173  200  Tolerance: ±1%  [RESC2012X60N]
R174  200  Tolerance: ±1%  [RESC2012X60N]
R175  200  Tolerance: ±1%  [RESC2012X60N]
R195  47  Tolerance: ±1%  [RESC2012X60N]
X16  HDMI  [TYCO_2007435-1]
X33  HDMI  [TYCO_2007435-1]

### Ports
HDMIC0 (harness HDMI_SIG), HDMIC1 (harness HDMI_SIG), HDMIC_0_LHC_CLK_N (in), HDMIC_0_LHC_CLK_P (in), HDMIC_1_LHC_CLK_N (in), HDMIC_1_LHC_CLK_P (in), TCM_SPI_CLKC_0 (in), TCM_SPI_CLKC_1 (in), TCM_SPI_MISOC_0 (out), TCM_SPI_MISOC_1 (out), TCM_SPI_MOSIC_0 (in), TCM_SPI_MOSIC_1 (in), TCM_SPI_SELC_0 (in), TCM_SPI_SELC_1 (in)

### Harnesses
HDMI_SIG: TCM_DT1_P, TCM_DT1_N, TCM_DT0_P, TCM_DT0_N, TCM_DA1_P, TCM_DA1_N, TCM_DA0_P, TCM_DA0_N

### Nets
GND: C216.1 C228.1 C240.1 DD18.7(GND) DD31.7(GND) DD34.7(GND) R173.1 R175.1 X16.2 X16.5 X16.8 X16.11 X16.17 X16.SHIELD X33.2 X33.5 X33.8 X33.11 X33.17 X33.SHIELD
P3V3: C216.2 C228.2 C240.2 DD18.14(VCC) DD31.14(VCC) DD34.14(VCC) R171.2 R174.2  [also labelled VCC]
FMC_HDMIC0_TCM_DA0_N: X33.12 ; port HDMIC0.TCM_DA0_N  [project net HDMIC0.TCM_DA0_N]
FMC_HDMIC0_TCM_DA0_P: X33.10 ; port HDMIC0.TCM_DA0_P  [project net HDMIC0.TCM_DA0_P]
FMC_HDMIC0_TCM_DA1_N: X33.9 ; port HDMIC0.TCM_DA1_N  [project net HDMIC0.TCM_DA1_N]
FMC_HDMIC0_TCM_DA1_P: X33.7 ; port HDMIC0.TCM_DA1_P  [project net HDMIC0.TCM_DA1_P]
FMC_HDMIC0_TCM_DT0_N: X33.6 ; port HDMIC0.TCM_DT0_N  [project net HDMIC0.TCM_DT0_N]
FMC_HDMIC0_TCM_DT0_P: X33.4 ; port HDMIC0.TCM_DT0_P  [project net HDMIC0.TCM_DT0_P]
FMC_HDMIC0_TCM_DT1_N: X33.3 ; port HDMIC0.TCM_DT1_N  [project net HDMIC0.TCM_DT1_N]
FMC_HDMIC0_TCM_DT1_P: X33.1 ; port HDMIC0.TCM_DT1_P  [project net HDMIC0.TCM_DT1_P]
FMC_HDMIC1_TCM_DA0_N: X16.12 ; port HDMIC1.TCM_DA0_N  [project net HDMIC1.TCM_DA0_N]
FMC_HDMIC1_TCM_DA0_P: X16.10 ; port HDMIC1.TCM_DA0_P  [project net HDMIC1.TCM_DA0_P]
FMC_HDMIC1_TCM_DA1_N: X16.9 ; port HDMIC1.TCM_DA1_N  [project net HDMIC1.TCM_DA1_N]
FMC_HDMIC1_TCM_DA1_P: X16.7 ; port HDMIC1.TCM_DA1_P  [project net HDMIC1.TCM_DA1_P]
FMC_HDMIC1_TCM_DT0_N: X16.6 ; port HDMIC1.TCM_DT0_N  [project net HDMIC1.TCM_DT0_N]
FMC_HDMIC1_TCM_DT0_P: X16.4 ; port HDMIC1.TCM_DT0_P  [project net HDMIC1.TCM_DT0_P]
FMC_HDMIC1_TCM_DT1_N: X16.3 ; port HDMIC1.TCM_DT1_N  [project net HDMIC1.TCM_DT1_N]
FMC_HDMIC1_TCM_DT1_P: X16.1 ; port HDMIC1.TCM_DT1_P  [project net HDMIC1.TCM_DT1_P]
HDMIC_0_LHC_CLK_N: X33.19 ; port HDMIC_0_LHC_CLK_N  [project net HDMIC_LHC.0_LHC_CLK_N]
HDMIC_0_LHC_CLK_P: X33.14 ; port HDMIC_0_LHC_CLK_P  [project net HDMIC_LHC.0_LHC_CLK_P]
HDMIC_1_LHC_CLK_N: X16.19 ; port HDMIC_1_LHC_CLK_N  [project net HDMIC_LHC.1_LHC_CLK_N]
HDMIC_1_LHC_CLK_P: X16.14 ; port HDMIC_1_LHC_CLK_P  [project net HDMIC_LHC.1_LHC_CLK_P]
TCM_SPI_CLKC_0: DD31.12(B) DD31.13(A) ; port TCM_SPI_CLKC_0
TCM_SPI_CLKC_1: DD18.9(B) DD18.10(A) ; port TCM_SPI_CLKC_1
TCM_SPI_MISOC_0: DD34.10(OUT) ; port TCM_SPI_MISOC_0
TCM_SPI_MISOC_1: DD34.12(OUT) ; port TCM_SPI_MISOC_1
TCM_SPI_MOSIC_0: DD18.1(A) DD18.2(B) ; port TCM_SPI_MOSIC_0
TCM_SPI_MOSIC_1: DD18.12(B) DD18.13(A) ; port TCM_SPI_MOSIC_1
TCM_SPI_SELC_0: DD31.9(B) DD31.10(A) ; port TCM_SPI_SELC_0
TCM_SPI_SELC_1: DD18.4(A) DD18.5(B) ; port TCM_SPI_SELC_1
NetDD18_3: DD18.3(Y) R10.2
NetDD18_6: DD18.6(Y) R12.2
NetDD18_8: DD18.8(Y) R17.2
NetDD18_11: DD18.11(Y) R25.2
NetDD31_8: DD31.8(Y) R195.2
NetDD31_11: DD31.11(Y) R8.2
NetDD34_11: DD34.11(IN) R171.1 R173.2 X33.18
NetDD34_13: DD34.13(IN) R174.1 R175.2 X16.18
NetR8_1: R8.1 X33.15
NetR10_1: R10.1 X33.16
NetR12_1: R12.1 X16.13
NetR17_1: R17.1 X16.15
NetR25_1: R25.1 X16.16
NetR195_1: R195.1 X33.13

### Notes on the sheet
- Project/Equipment
- Document
- Designer
- Drawn by
- Check.by
- Copyright WUT ISE 2024.
  This documentation describes Open Hardware and is licensed under the CERN OHL v.2. You may redistribute and modify this documentation under the terms of the CERN OHL v.2. (http://ohwr.org/CERNOHL). This documentation is distributed WITHOUT ANY EXPRESS OR IMPLIED WARRANTY, INCLUDING OF MERCHANTABILITY, SATISFACTORY QUALITY AND FITNESS FOR A PARTICULAR PURPOSE. Please see the CERN OHL v.2 for applicable conditions.
- Contact
- File
- Last Mod.
- Print Date
- Sheet
- Size
- A3
- of
- Rev

### Library data of the parts
C216 C228 C240 = CC0805_220NF_50V_10%_X7R: as C17 on sheet FIT_HDMI_X21-17; Part Number: CC0805_220NF_50V_10%_X7R; Component Kind: Standard; Component Type: Standard; Pin Count: 2; Value: 220nF; Status: Preferred; Manufacturer Part Number: CC0805_220NF_50V_10%_X7R; Case: 0805; Mounted: Yes; Socket: No; SMD: Yes; Sense: No; Manufacturer1 Example: MURATA; Manufacturer1 ComponentHeight: 1.35mm; HelpURL: \\cern.ch\dfs\Applications\Altium\Datasheets\CC0805_X7R_MURATA.pdf; Author: CERN DEM JLC; CreateDate: 03.12.2007; LatestRevisionDate: 03.12.2007
DD18 DD31 = SN74LVC08AD: as DD25 on sheet FIT_HDMI_X21-17; Part Number: SN74LVC08AD; Component Kind: Standard; Component Type: Standard; Device: SN74LVC08AD; PackageDescription: SOIC 14, Pitch 1.27mm - Body 4x8.75mm, IPC Medium Density; Manufacturer Part Number: SN74LVC08AD; Pin Count: 14; Case: SOIC14; Mounted: Yes; Socket: No; SMD: Yes; Sense: No; ComponentHeight: 1.75mm; Author: CERN DEM JLC; HelpURL: \\cern.ch\dfs\Applications\Altium\Datasheets\SN74LVC08AD.pdf; CreateDate: 21.03.2012; LatestRevisionDate: 21.03.2012
DD34 = SN74LVC14AD: as DD35 on sheet FIT_HDMI_X21-17; Part Number: SN74LVC14AD; Component Kind: Standard; Component Type: Standard; Device: SN74LVC14AD; PackageDescription: SOIC 14, Pitch 1.27mm - Body 4x8.75mm, IPC Medium Density; Part Description: Hex Schmitt-Trigger Inverter; Manufacturer Part Number: SN74LVC14AD; Pin Count: 14; Case: SOIC14; Mounted: Yes; Socket: No; SMD: Yes; Sense: No; ComponentHeight: 1.75mm; Author: CERN DEM JMW; HelpURL: \\cern.ch\dfs\Applications\Altium\Datasheets\SN74LVC14AD.pdf; CreateDate: 29.09.2008; LatestRevisionDate: 29.09.2008
R8 R10 R12 R17 R25 R195 = R0805_47R_1%_0.125W_100PPM: as R63 on sheet FIT_HDMI_X21-17; Part Number: R0805_47R_1%_0.125W_100PPM; Component Kind: Standard; Component Type: Standard; Pin Count: 2; Value: 47; Status: Preferred; Manufacturer Part Number: R0805_47R_1%_0.125W_100PPM; Case: 0805; Mounted: Yes; Sense: No; Socket: No; SMD: Yes; Manufacturer1 Example: NIC COMPONENT; Manufacturer1 ComponentHeight: 0.6mm; HelpURL: \\cern.ch\dfs\Applications\Altium\Datasheets\R0805_NIC_NRC.pdf; Author: CERN DEM JLC; CreateDate: 03.12.2007; LatestRevisionDate: 13.03.2008
R171 R173-R175 = R0805_200R_1%_0.125W_100PPM: as R184-R187 on sheet FIT_HDMI_X21-17; Part Number: R0805_200R_1%_0.125W_100PPM; Component Kind: Standard; Component Type: Standard; Pin Count: 2; Value: 200; Status: Preferred; Manufacturer Part Number: R0805_200R_1%_0.125W_100PPM; Case: 0805; Mounted: Yes; Sense: No; Socket: No; SMD: Yes; Manufacturer1 Example: NIC COMPONENT; Manufacturer1 ComponentHeight: 0.6mm; HelpURL: \\cern.ch\dfs\Applications\Altium\Datasheets\R0805_NIC_NRC.pdf; Author: CERN DEM JLC; CreateDate: 03.12.2007; LatestRevisionDate: 13.03.2008
X16 X33 = TYCO_2007435-1: as X17 on sheet FIT_HDMI_X21-17; Part Number: TYCO_2007435-1; Component Kind: Standard; Component Type: Standard; Pin Count: 23; Family: HDMI; Mounted: Yes; Socket: No; SMD: No; Sense: No; Status: None; Manufacturer Part Number: 2007435-1; ComponentHeight: 16.4mm; HelpURL: \\cern.ch\dfs\Applications\Altium\Datasheets\TYCO_2007435-1.pdf; Author: CERN DEM MR; CreateDate: 05.07.2016; LatestRevisionDate: 05.07.2016

## Sheet FIT_HDMI_X25-29.SchDoc: FIT_PM12 board
size 420 x 297 mm; CheckedBy: G.Kasprowicz; Author: INR Moscow; CompanyName: WUT ISE; DrawnBy: M.Podgórski; Organization: WUT ISE; Address1: PW ISE; Address2: Nowowiejska 15/19 00-665 Warsaw; Address3: gkasprow@gmail.com; Revision: 2; SheetNumber: -; SheetTotal: -; ModifiedBy: -; CheckedDate: -; Title2: Title 2; DivGrp: WUT ISE; Designer: INR RAS; ModifiedDate: -; ProjectName: Sensor Box
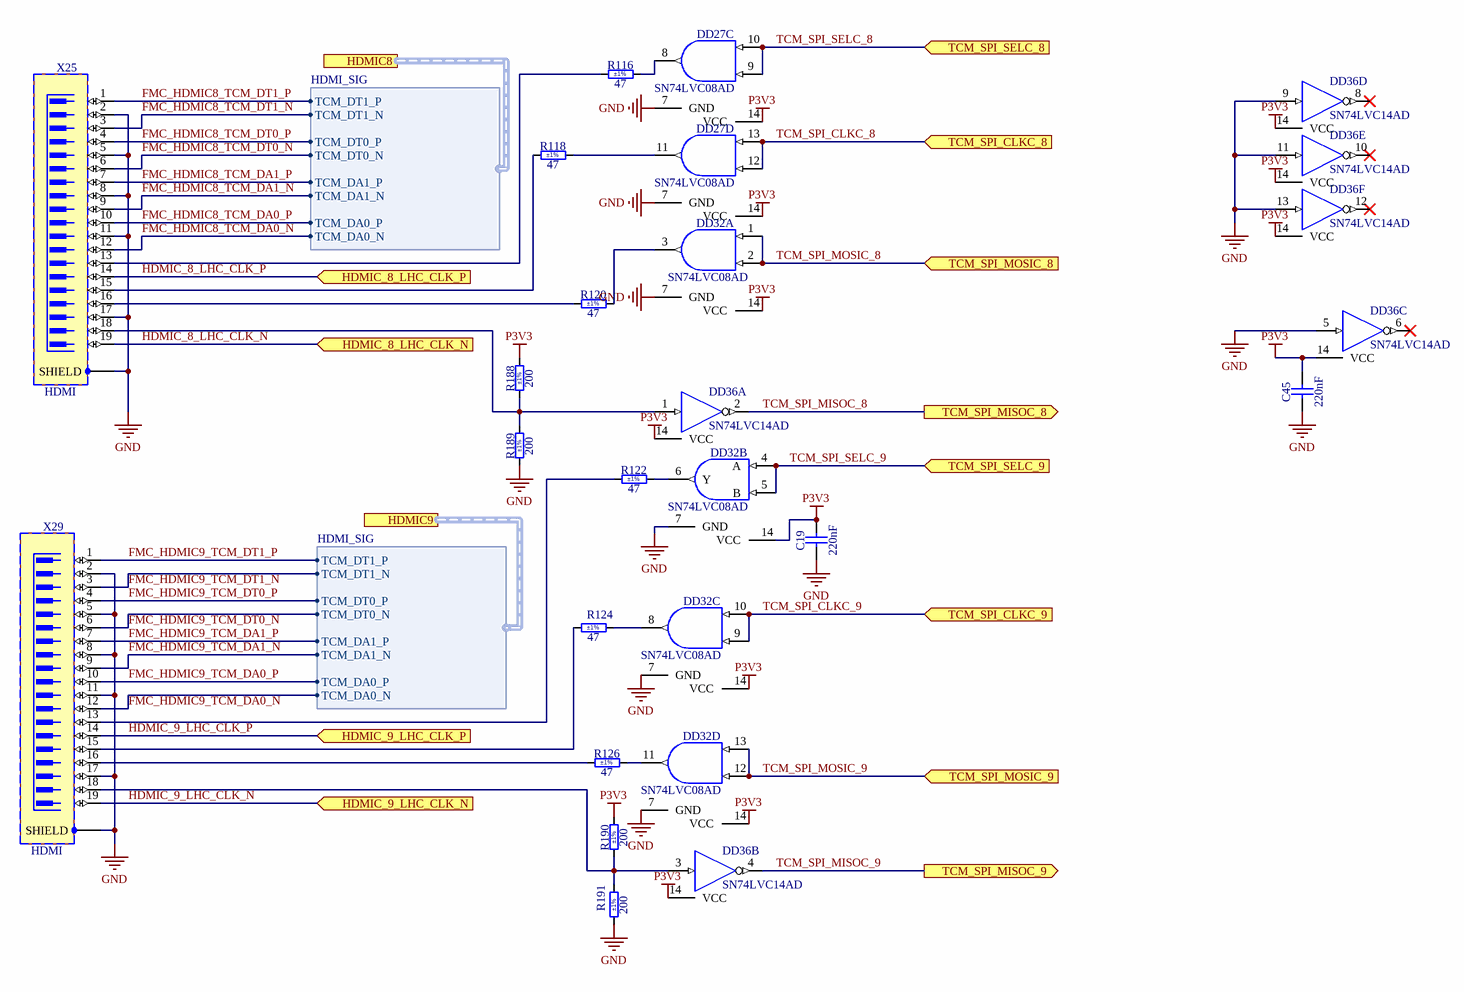
[diagram p31: FIT_HDMI_X25-29.SchDoc]

### Parts
C19  220nF  [CAPC2012X135N]
C45  220nF  [CAPC2012X135N]
DD27  SN74LVC08AD  [SOIC127P600X175-14N]  (parts C,D of 4)
DD32  SN74LVC08AD  [SOIC127P600X175-14N]  (parts A,B,C,D of 4)
DD36  SN74LVC14AD  [SOIC127P600X175-14N]  (parts A,B,C,D,E,F of 6)
R116  47  Tolerance: ±1%  [RESC2012X60N]
R118  47  Tolerance: ±1%  [RESC2012X60N]
R120  47  Tolerance: ±1%  [RESC2012X60N]
R122  47  Tolerance: ±1%  [RESC2012X60N]
R124  47  Tolerance: ±1%  [RESC2012X60N]
R126  47  Tolerance: ±1%  [RESC2012X60N]
R188  200  Tolerance: ±1%  [RESC2012X60N]
R189  200  Tolerance: ±1%  [RESC2012X60N]
R190  200  Tolerance: ±1%  [RESC2012X60N]
R191  200  Tolerance: ±1%  [RESC2012X60N]
X25  HDMI  [TYCO_2007435-1]
X29  HDMI  [TYCO_2007435-1]

### Ports
HDMIC8 (harness HDMI_SIG), HDMIC9 (harness HDMI_SIG), HDMIC_8_LHC_CLK_N (in), HDMIC_8_LHC_CLK_P (in), HDMIC_9_LHC_CLK_N (in), HDMIC_9_LHC_CLK_P (in), TCM_SPI_CLKC_8 (in), TCM_SPI_CLKC_9 (in), TCM_SPI_MISOC_8 (out), TCM_SPI_MISOC_9 (out), TCM_SPI_MOSIC_8 (in), TCM_SPI_MOSIC_9 (in), TCM_SPI_SELC_8 (in), TCM_SPI_SELC_9 (in)

### Harnesses
HDMI_SIG: TCM_DT1_P, TCM_DT1_N, TCM_DT0_P, TCM_DT0_N, TCM_DA1_P, TCM_DA1_N, TCM_DA0_P, TCM_DA0_N

### Nets
GND: C19.1 C45.1 DD27.7(GND) DD32.7(GND) DD36.5(IN) DD36.7(GND) DD36.9(IN) DD36.11(IN) DD36.13(IN) R189.1 R191.1 X25.2 X25.5 X25.8 X25.11 X25.17 X25.SHIELD X29.2 X29.5 X29.8 X29.11 X29.17 X29.SHIELD
P3V3: C19.2 C45.2 DD27.14(VCC) DD32.14(VCC) DD36.14(VCC) R188.2 R190.2  [also labelled VCC]
FMC_HDMIC8_TCM_DA0_N: X25.12 ; port HDMIC8.TCM_DA0_N  [project net HDMIC8.TCM_DA0_N]
FMC_HDMIC8_TCM_DA0_P: X25.10 ; port HDMIC8.TCM_DA0_P  [project net HDMIC8.TCM_DA0_P]
FMC_HDMIC8_TCM_DA1_N: X25.9 ; port HDMIC8.TCM_DA1_N  [project net HDMIC8.TCM_DA1_N]
FMC_HDMIC8_TCM_DA1_P: X25.7 ; port HDMIC8.TCM_DA1_P  [project net HDMIC8.TCM_DA1_P]
FMC_HDMIC8_TCM_DT0_N: X25.6 ; port HDMIC8.TCM_DT0_N  [project net HDMIC8.TCM_DT0_N]
FMC_HDMIC8_TCM_DT0_P: X25.4 ; port HDMIC8.TCM_DT0_P  [project net HDMIC8.TCM_DT0_P]
FMC_HDMIC8_TCM_DT1_N: X25.3 ; port HDMIC8.TCM_DT1_N  [project net HDMIC8.TCM_DT1_N]
FMC_HDMIC8_TCM_DT1_P: X25.1 ; port HDMIC8.TCM_DT1_P  [project net HDMIC8.TCM_DT1_P]
FMC_HDMIC9_TCM_DA0_N: X29.12 ; port HDMIC9.TCM_DA0_N  [project net HDMIC9.TCM_DA0_N]
FMC_HDMIC9_TCM_DA0_P: X29.10 ; port HDMIC9.TCM_DA0_P  [project net HDMIC9.TCM_DA0_P]
FMC_HDMIC9_TCM_DA1_N: X29.9 ; port HDMIC9.TCM_DA1_N  [project net HDMIC9.TCM_DA1_N]
FMC_HDMIC9_TCM_DA1_P: X29.7 ; port HDMIC9.TCM_DA1_P  [project net HDMIC9.TCM_DA1_P]
FMC_HDMIC9_TCM_DT0_N: X29.6 ; port HDMIC9.TCM_DT0_N  [project net HDMIC9.TCM_DT0_N]
FMC_HDMIC9_TCM_DT0_P: X29.4 ; port HDMIC9.TCM_DT0_P  [project net HDMIC9.TCM_DT0_P]
FMC_HDMIC9_TCM_DT1_N: X29.3 ; port HDMIC9.TCM_DT1_N  [project net HDMIC9.TCM_DT1_N]
FMC_HDMIC9_TCM_DT1_P: X29.1 ; port HDMIC9.TCM_DT1_P  [project net HDMIC9.TCM_DT1_P]
HDMIC_8_LHC_CLK_N: X25.19 ; port HDMIC_8_LHC_CLK_N  [project net HDMIC_LHC.8_LHC_CLK_N]
HDMIC_8_LHC_CLK_P: X25.14 ; port HDMIC_8_LHC_CLK_P  [project net HDMIC_LHC.8_LHC_CLK_P]
HDMIC_9_LHC_CLK_N: X29.19 ; port HDMIC_9_LHC_CLK_N  [project net HDMIC_LHC.9_LHC_CLK_N]
HDMIC_9_LHC_CLK_P: X29.14 ; port HDMIC_9_LHC_CLK_P  [project net HDMIC_LHC.9_LHC_CLK_P]
TCM_SPI_CLKC_8: DD27.12(B) DD27.13(A) ; port TCM_SPI_CLKC_8
TCM_SPI_CLKC_9: DD32.9(B) DD32.10(A) ; port TCM_SPI_CLKC_9
TCM_SPI_MISOC_8: DD36.2(OUT) ; port TCM_SPI_MISOC_8
TCM_SPI_MISOC_9: DD36.4(OUT) ; port TCM_SPI_MISOC_9
TCM_SPI_MOSIC_8: DD32.1(A) DD32.2(B) ; port TCM_SPI_MOSIC_8
TCM_SPI_MOSIC_9: DD32.12(B) DD32.13(A) ; port TCM_SPI_MOSIC_9
TCM_SPI_SELC_8: DD27.9(B) DD27.10(A) ; port TCM_SPI_SELC_8
TCM_SPI_SELC_9: DD32.4(A) DD32.5(B) ; port TCM_SPI_SELC_9
NetDD27_8: DD27.8(Y) R116.2
NetDD27_11: DD27.11(Y) R118.2
NetDD32_3: DD32.3(Y) R120.2
NetDD32_6: DD32.6(Y) R122.2
NetDD32_8: DD32.8(Y) R124.2
NetDD32_11: DD32.11(Y) R126.2
NetDD36_1: DD36.1(IN) R188.1 R189.2 X25.18
NetDD36_3: DD36.3(IN) R190.1 R191.2 X29.18
NetR116_1: R116.1 X25.13
NetR118_1: R118.1 X25.15
NetR120_1: R120.1 X25.16
NetR122_1: R122.1 X29.13
NetR124_1: R124.1 X29.15
NetR126_1: R126.1 X29.16

Not connected (* = marked no-connect by the designer): DD36 6(OUT)* 8(OUT)* 10(OUT)* 12(OUT)*

### Notes on the sheet
- Project/Equipment
- Document
- Designer
- Drawn by
- Check.by
- Copyright WUT ISE 2024.
  This documentation describes Open Hardware and is licensed under the CERN OHL v.2. You may redistribute and modify this documentation under the terms of the CERN OHL v.2. (http://ohwr.org/CERNOHL). This documentation is distributed WITHOUT ANY EXPRESS OR IMPLIED WARRANTY, INCLUDING OF MERCHANTABILITY, SATISFACTORY QUALITY AND FITNESS FOR A PARTICULAR PURPOSE. Please see the CERN OHL v.2 for applicable conditions.
- Contact
- File
- Last Mod.
- Print Date
- Sheet
- Size
- A3
- of
- Rev

### Library data of the parts
C19 C45 = CC0805_220NF_50V_10%_X7R: as C17 on sheet FIT_HDMI_X21-17; Part Number: CC0805_220NF_50V_10%_X7R; Component Kind: Standard; Component Type: Standard; Pin Count: 2; Value: 220nF; Status: Preferred; Manufacturer Part Number: CC0805_220NF_50V_10%_X7R; Case: 0805; Mounted: Yes; Socket: No; SMD: Yes; Sense: No; Manufacturer1 Example: MURATA; Manufacturer1 ComponentHeight: 1.35mm; HelpURL: \\cern.ch\dfs\Applications\Altium\Datasheets\CC0805_X7R_MURATA.pdf; Author: CERN DEM JLC; CreateDate: 03.12.2007; LatestRevisionDate: 03.12.2007
DD27 DD32 = SN74LVC08AD: as DD25 on sheet FIT_HDMI_X21-17; Part Number: SN74LVC08AD; Component Kind: Standard; Component Type: Standard; Device: SN74LVC08AD; PackageDescription: SOIC 14, Pitch 1.27mm - Body 4x8.75mm, IPC Medium Density; Manufacturer Part Number: SN74LVC08AD; Pin Count: 14; Case: SOIC14; Mounted: Yes; Socket: No; SMD: Yes; Sense: No; ComponentHeight: 1.75mm; Author: CERN DEM JLC; HelpURL: \\cern.ch\dfs\Applications\Altium\Datasheets\SN74LVC08AD.pdf; CreateDate: 21.03.2012; LatestRevisionDate: 21.03.2012
DD36 = SN74LVC14AD: as DD35 on sheet FIT_HDMI_X21-17; Part Number: SN74LVC14AD; Component Kind: Standard; Component Type: Standard; Device: SN74LVC14AD; PackageDescription: SOIC 14, Pitch 1.27mm - Body 4x8.75mm, IPC Medium Density; Part Description: Hex Schmitt-Trigger Inverter; Manufacturer Part Number: SN74LVC14AD; Pin Count: 14; Case: SOIC14; Mounted: Yes; Socket: No; SMD: Yes; Sense: No; ComponentHeight: 1.75mm; Author: CERN DEM JMW; HelpURL: \\cern.ch\dfs\Applications\Altium\Datasheets\SN74LVC14AD.pdf; CreateDate: 29.09.2008; LatestRevisionDate: 29.09.2008
R116 R118 R120 R122 R124 R126 = R0805_47R_1%_0.125W_100PPM: as R63 on sheet FIT_HDMI_X21-17; Part Number: R0805_47R_1%_0.125W_100PPM; Component Kind: Standard; Component Type: Standard; Pin Count: 2; Value: 47; Status: Preferred; Manufacturer Part Number: R0805_47R_1%_0.125W_100PPM; Case: 0805; Mounted: Yes; Sense: No; Socket: No; SMD: Yes; Manufacturer1 Example: NIC COMPONENT; Manufacturer1 ComponentHeight: 0.6mm; HelpURL: \\cern.ch\dfs\Applications\Altium\Datasheets\R0805_NIC_NRC.pdf; Author: CERN DEM JLC; CreateDate: 03.12.2007; LatestRevisionDate: 13.03.2008
R188-R191 = R0805_200R_1%_0.125W_100PPM: as R184-R187 on sheet FIT_HDMI_X21-17; Part Number: R0805_200R_1%_0.125W_100PPM; Component Kind: Standard; Component Type: Standard; Pin Count: 2; Value: 200; Status: Preferred; Manufacturer Part Number: R0805_200R_1%_0.125W_100PPM; Case: 0805; Mounted: Yes; Sense: No; Socket: No; SMD: Yes; Manufacturer1 Example: NIC COMPONENT; Manufacturer1 ComponentHeight: 0.6mm; HelpURL: \\cern.ch\dfs\Applications\Altium\Datasheets\R0805_NIC_NRC.pdf; Author: CERN DEM JLC; CreateDate: 03.12.2007; LatestRevisionDate: 13.03.2008
X25 X29 = TYCO_2007435-1: as X17 on sheet FIT_HDMI_X21-17; Part Number: TYCO_2007435-1; Component Kind: Standard; Component Type: Standard; Pin Count: 23; Family: HDMI; Mounted: Yes; Socket: No; SMD: No; Sense: No; Status: None; Manufacturer Part Number: 2007435-1; ComponentHeight: 16.4mm; HelpURL: \\cern.ch\dfs\Applications\Altium\Datasheets\TYCO_2007435-1.pdf; Author: CERN DEM MR; CreateDate: 05.07.2016; LatestRevisionDate: 05.07.2016